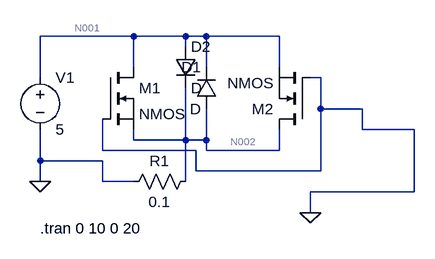
[diagram p0: schematic Draft1.asc]
Draft1.asc, the LTspice schematic file:
Version 4
SHEET 1 880 680
WIRE 160 64 16 64
WIRE 240 64 160 64
WIRE 272 64 240 64
WIRE 384 64 272 64
WIRE 240 80 240 64
WIRE 160 112 160 64
WIRE 272 112 272 64
WIRE 384 112 384 64
WIRE 16 128 16 64
WIRE 448 128 432 128
WIRE 448 176 448 128
WIRE 512 176 448 176
WIRE 512 208 512 176
WIRE 592 208 512 208
WIRE 160 224 160 208
WIRE 240 224 240 144
WIRE 240 224 160 224
WIRE 272 224 272 176
WIRE 272 224 240 224
WIRE 112 240 112 192
WIRE 256 240 112 240
WIRE 272 240 272 224
WIRE 384 240 384 208
WIRE 384 240 272 240
WIRE 16 256 16 208
WIRE 112 256 16 256
WIRE 256 272 256 240
WIRE 448 272 448 176
WIRE 448 272 256 272
WIRE 16 288 16 256
WIRE 112 288 112 256
WIRE 160 288 112 288
WIRE 240 288 240 224
WIRE 592 304 592 208
WIRE 592 304 432 304
WIRE 432 336 432 304
FLAG 16 288 0
FLAG 432 336 0
SYMBOL voltage 16 112 R0
WINDOW 123 0 0 Left 0
WINDOW 39 0 0 Left 0
SYMATTR InstName V1
SYMATTR Value 5
SYMBOL nmos 112 112 R0
SYMATTR InstName M1
SYMBOL nmos 432 208 R180
SYMATTR InstName M2
SYMBOL diode 288 176 R180
WINDOW 0 24 64 Left 2
WINDOW 3 24 0 Left 2
SYMATTR InstName D1
SYMBOL diode 224 80 R0
SYMATTR InstName D2
SYMBOL res 256 272 R90
WINDOW 0 0 56 VBottom 2
WINDOW 3 32 56 VTop 2
SYMATTR InstName R1
SYMATTR Value 0.1
TEXT 16 360 Left 2 !.tran 0 10 0 20

The netlist it stands for:
* Draft1.asc
V1 N001 0 5
M1 N001 0 N002 N002 NMOS
M2 N002 0 N001 N001 NMOS
D1 N002 N001 D
D2 N001 N002 D
R1 N002 0 0.1
.model D D
.lib standard.dio
.model NMOS NMOS
.model PMOS PMOS
.lib standard.mos
.tran 0 10 0 20
.backanno
.end

* Results of the author's LTspice run, read from the files saved beside the schematic
* Operating Point, zero values left out:
*   V(n001) = 5 V
*   V(n002) = 4.088 V
*   Id(M1) = 1.834 pA
*   Id(M2) = -20.44 A
*   Ib(M2) = 20.44 A
*   I(D2) = 20.44 A
*   I(R1) = 40.88 A
*   I(V1) = -40.88 A